# EAGLE schematic main (EAGLE 6.2)
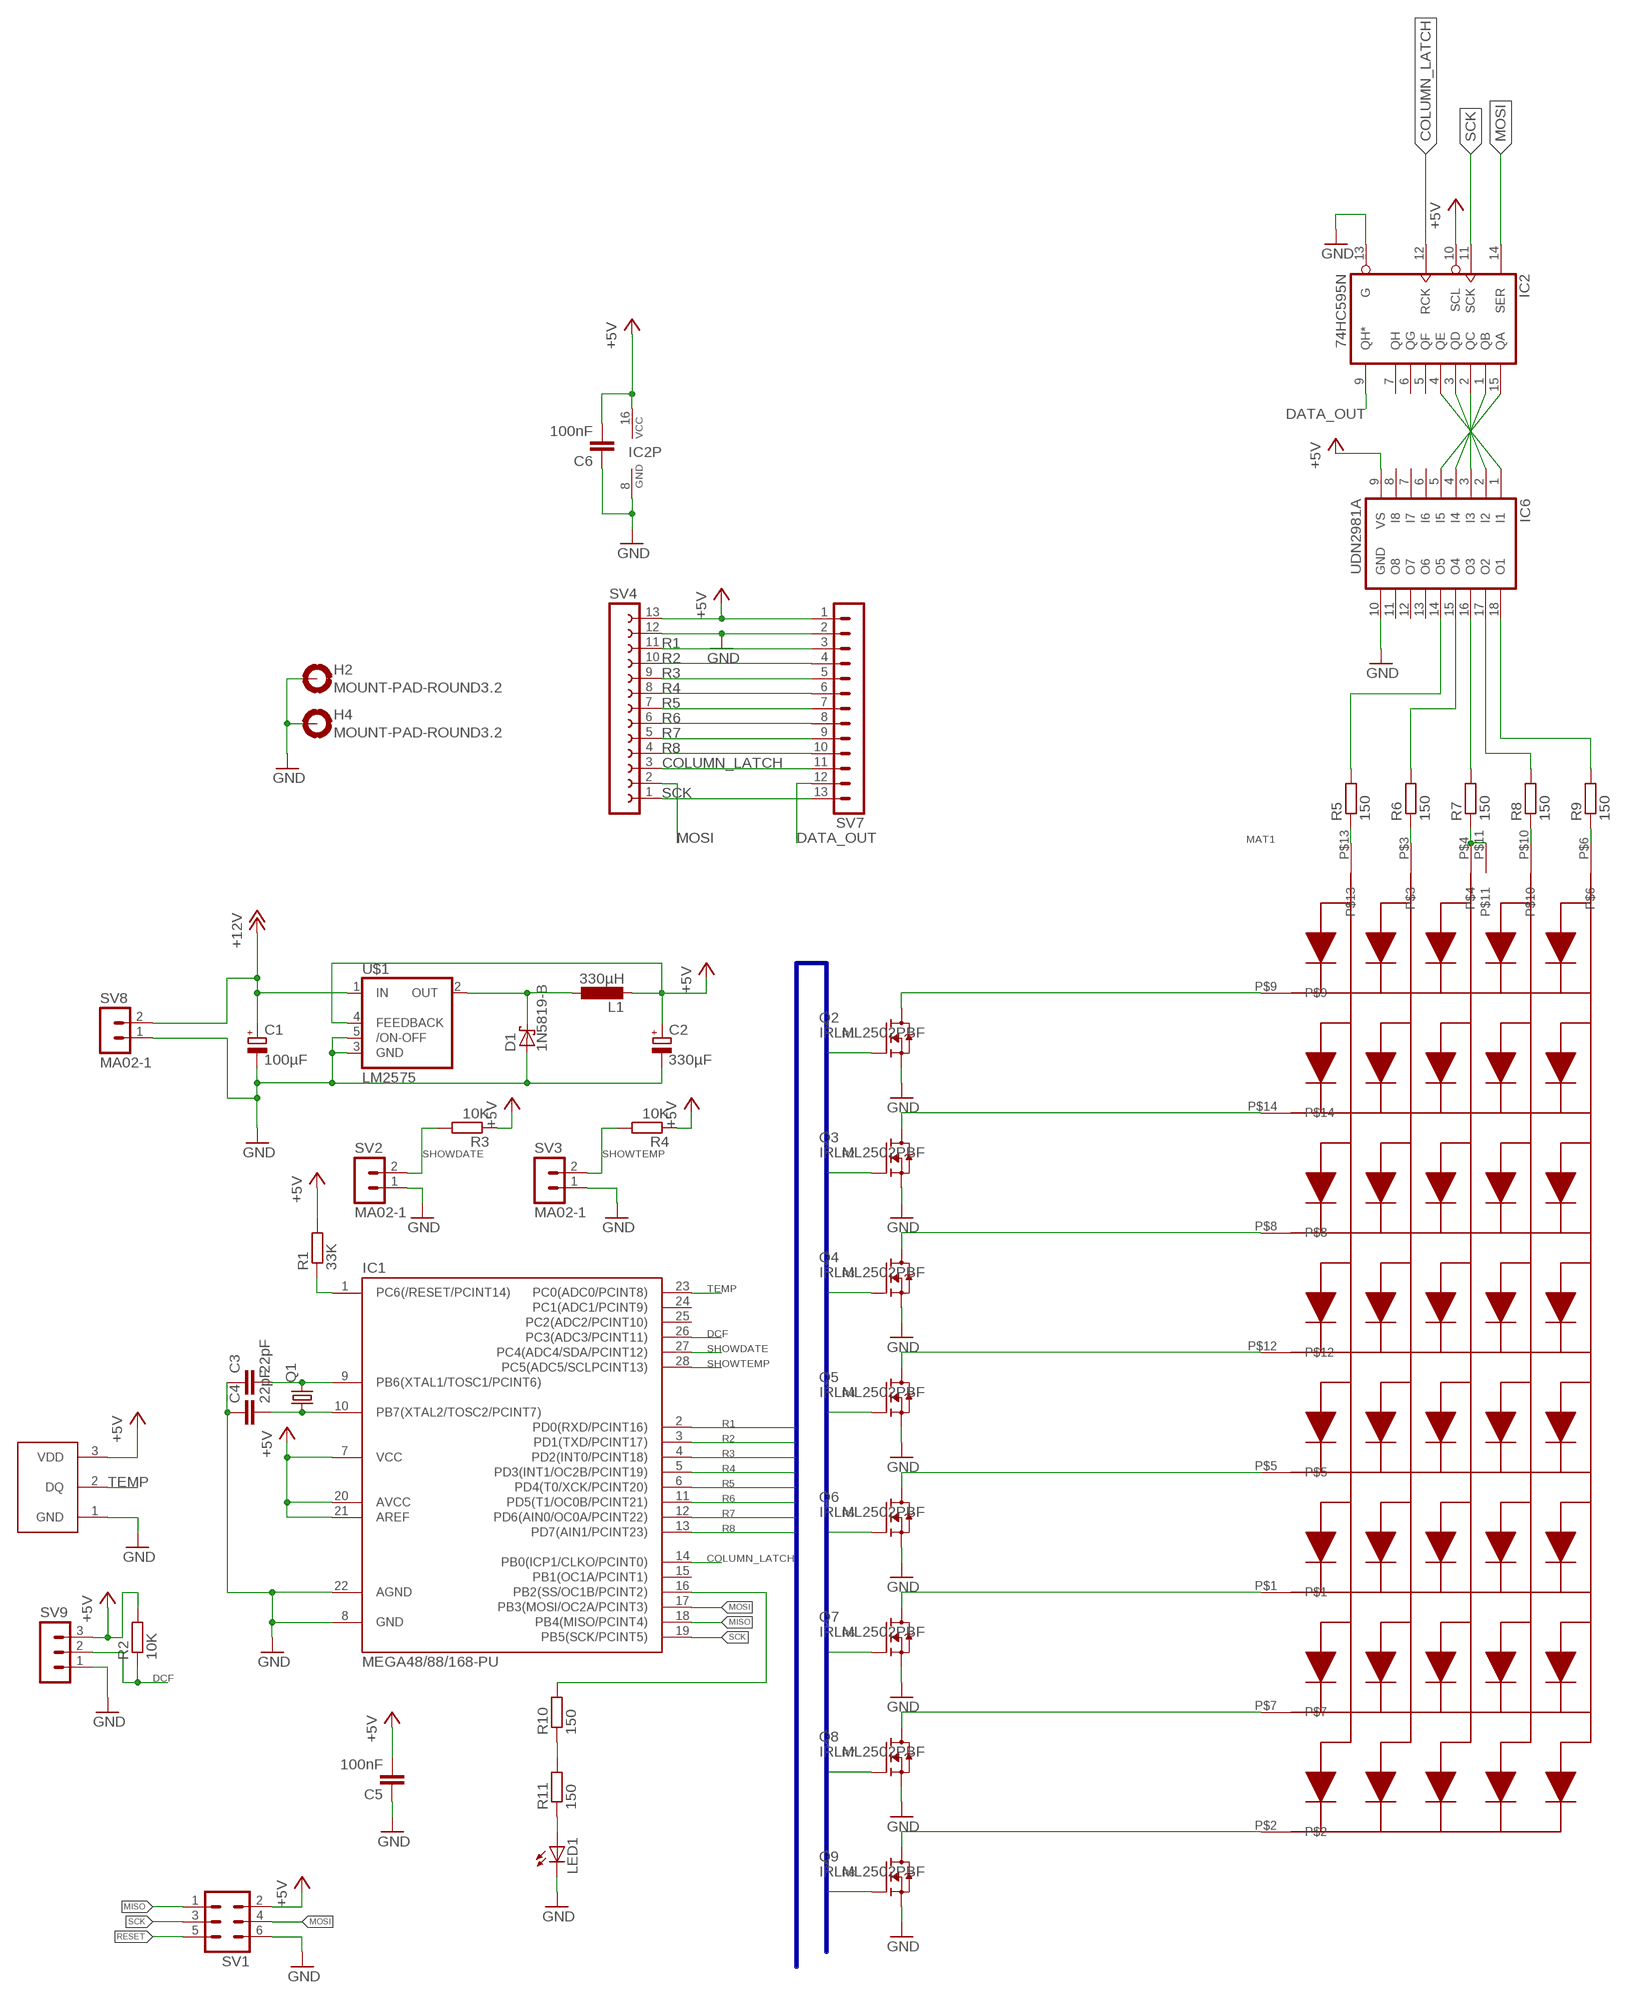
[diagram p0: schematic, sheet 1]

## Parts
C1  100µF  CPOL-EUE2.5-5  [E2,5-5]
C2  330µF  CPOL-EUE3.5-8  [E3,5-8]
C3  22pF  C-EU025-025X050  [C025-025X050]
C4  22pF  C-EU025-025X050  [C025-025X050]
C5  100nF  C-EUC0805  [C0805]
C6  100nF  C-EUC0805  [C0805]
D1  1N5819-B  [DO41-7.6]
H2  MOUNT-PAD-ROUND3.2  [3,2-PAD]
H4  MOUNT-PAD-ROUND3.2  [3,2-PAD]
IC1  MEGA48/88/168-PU  [DIL28-3]
IC2  74HC595N  [DIL16]
IC6  UDN2981A  [DIL18]
L1  330µH  L-EU0204V  [0204V]
LED1  LEDSML1206  [SML1206]
MAT1  5X8  [5X8]
Q1  CRYSTALHC49S  [HC49/S]
Q2  IRLML2502PBF  [SOT23]
Q3  IRLML2502PBF  [SOT23]
Q4  IRLML2502PBF  [SOT23]
Q5  IRLML2502PBF  [SOT23]
Q6  IRLML2502PBF  [SOT23]
Q7  IRLML2502PBF  [SOT23]
Q8  IRLML2502PBF  [SOT23]
Q9  IRLML2502PBF  [SOT23]
R1  33K  R-EU_R0805  [R0805]
R2  10K  R-EU_R0805  [R0805]
R3  10K  R-EU_R0805  [R0805]
R4  10K  R-EU_R0805  [R0805]
R5  150  R-EU_R0805  [R0805]
R6  150  R-EU_R0805  [R0805]
R7  150  R-EU_R0805  [R0805]
R8  150  R-EU_R0805  [R0805]
R9  150  R-EU_R0805  [R0805]
R10  150  R-EU_R0805  [R0805]
R11  150  R-EU_R0805  [R0805]
SV1  MA03-2  [MA03-2]
SV2  MA02-1  [MA02-1]
SV3  MA02-1  [MA02-1]
SV4  FE13W  [FE13W]
SV7  MA13-1W  [MA13-1W]
SV8  MA02-1  [MA02-1]
SV9  MA03-1  [MA03-1]
U$1  LM2575  [LM2575]
U$2  DS18B20  [TO92]

## Nets
+5V: C2.+ C5.2 C6.2 IC1.7(VCC) IC1.20(AVCC) IC1.21(AREF) IC2.10(SCL) IC2.16(VCC) IC6.9(VS) L1.2 R1.2 R2.2 R3.1 R4.1 SV1.2 SV4.13 SV7.1 SV9.3 U$1.4(FEEDBACK) U$2.3(VDD)
+12V: C1.+ SV8.2 U$1.1(IN)
COLUMN_LATCH: IC1.14(PB0(ICP1/CLKO/PCINT0)) IC2.12(RCK) SV4.3 SV7.11
DATA_OUT: IC2.9(QH*) SV7.12
DCF: IC1.26(PC3(ADC3/PCINT11)) R2.1 SV9.2
GND: C1.- C2.- C3.1 C4.1 C5.1 C6.1 D1.A H2.B3,2(MOUNT) H4.B3,2(MOUNT) IC1.8(GND) IC1.22(AGND) IC2.8(GND) IC2.13(G) IC6.10(GND) LED1.C Q2.2(S) Q3.2(S) Q4.2(S) Q5.2(S) Q6.2(S) Q7.2(S) Q8.2(S) Q9.2(S) SV1.6 SV2.1 SV3.1 SV4.12 SV7.2 SV8.1 SV9.1 U$1.3(GND) U$1.5(/ON-OFF) U$2.1(GND)
MISO: IC1.18(PB4(MISO/PCINT4)) SV1.1
MOSI: IC1.17(PB3(MOSI/OC2A/PCINT3)) IC2.14(SER) SV1.4 SV4.2
N$1: IC6.15(O4) R6.2
N$2: C4.2 IC1.10(PB7(XTAL2/TOSC2/PCINT7)) Q1.1
N$3: D1.C L1.1 U$1.2(OUT)
N$4: C3.2 IC1.9(PB6(XTAL1/TOSC1/PCINT6)) Q1.2
N$5: IC6.16(O3) R7.2
N$6: IC6.17(O2) R8.2
N$7: MAT1.P$10 R8.1
N$8: MAT1.P$4 MAT1.P$11 R7.1
N$9: IC2.15(QA) IC6.5(I5)
N$10: IC2.1(QB) IC6.4(I4)
N$11: IC2.2(QC) IC6.3(I3)
N$12: IC2.3(QD) IC6.2(I2)
N$13: IC2.4(QE) IC6.1(I1)
N$14: MAT1.P$6 R9.1
N$15: IC6.18(O1) R9.2
N$16: MAT1.P$3 R6.1
N$17: MAT1.P$13 R5.1
N$29: IC1.16(PB2(SS/OC1B/PCINT2)) R10.2
N$30: IC6.14(O5) R5.2
N$31: R10.1 R11.2
N$32: LED1.A R11.1
N$58: MAT1.P$9 Q2.3(D)
N$59: MAT1.P$2 Q9.3(D)
N$60: MAT1.P$7 Q8.3(D)
N$61: MAT1.P$1 Q7.3(D)
N$62: MAT1.P$5 Q6.3(D)
N$63: MAT1.P$12 Q5.3(D)
N$64: MAT1.P$8 Q4.3(D)
N$65: MAT1.P$14 Q3.3(D)
R1: IC1.2(PD0(RXD/PCINT16)) Q2.1(G) SV4.11 SV7.3
R2: IC1.3(PD1(TXD/PCINT17)) Q3.1(G) SV4.10 SV7.4
R3: IC1.4(PD2(INT0/PCINT18)) Q4.1(G) SV4.9 SV7.5
R4: IC1.5(PD3(INT1/OC2B/PCINT19)) Q5.1(G) SV4.8 SV7.6
R5: IC1.6(PD4(T0/XCK/PCINT20)) Q6.1(G) SV4.7 SV7.7
R6: IC1.11(PD5(T1/OC0B/PCINT21)) Q7.1(G) SV4.6 SV7.8
R7: IC1.12(PD6(AIN0/OC0A/PCINT22)) Q8.1(G) SV4.5 SV7.9
R8: IC1.13(PD7(AIN1/PCINT23)) Q9.1(G) SV4.4 SV7.10
RESET: IC1.1(PC6(/RESET/PCINT14)) R1.1 SV1.5
SCK: IC1.19(PB5(SCK/PCINT5)) IC2.11(SCK) SV1.3 SV4.1 SV7.13
SHOWDATE: IC1.27(PC4(ADC4/SDA/PCINT12)) R3.2 SV2.2
SHOWTEMP: IC1.28(PC5(ADC5/SCLPCINT13)) R4.2 SV3.2
TEMP: IC1.23(PC0(ADC0/PCINT8)) U$2.2(DQ)
Unconnected: IC1.15(PB1(OC1A/PCINT1)) IC1.24(PC1(ADC1/PCINT9)) IC1.25(PC2(ADC2/PCINT10)) IC2.5(QF) IC2.6(QG) IC2.7(QH) IC6.6(I6) IC6.7(I7) IC6.8(I8) IC6.11(O8) IC6.12(O7) IC6.13(O6)

## Buses
R[1..8]

## Library data of the parts
C1 C2 = rcl:CPOL-EU: POLARIZED CAPACITOR, European symbol
C3-C6 = rcl:C-EU: CAPACITOR, European symbol
D1 = diode:1N581*: 1.0A SCHOTTKY BARRIER RECTIFIER Source: http://www.diodes.com/datasheets/ds23001.pdf
H2 H4 = holes:MOUNT-PAD-ROUND: MOUNTING PAD, round
IC1 = avr-7:MEGA48/88/168-PU
IC2 = 74xx-eu:74*595: 8-bit SHIFT REGISTER, output latch
IC6 = uln-udn:UDN298*: DRIVER ARRAY Source: Allegro Microsystems Inc. / UDN2981-UDN2984.pdf
L1 = rcl:L-EU: INDUCTOR, European symbol
LED1 = led:LED: LED OSRAM: - CHIPLED LG R971, LG N971, LY N971, LG Q971, LY Q971, LO R971, LY R971 LH N974, LH R974 LS Q976, LO Q976, LY Q976 LO Q996 - Hyper CHIPLED LW Q18S LB Q993, LB Q99A, LB R99A - SideLED LS A670, LO A670, LY A670, LG A670, LP A670 LB A673, LV A673, LT A673, LW A673 LH A674 LY A675 LS A676, LA A676, LO A676, LY A676, LW A676 LS A679, LY A679, LG A679 - Hyper Micro SIDELED® LS Y876, LA Y876, LO Y876, LY Y876 LT Y87S - SmartLED LW L88C, LW L88S LB L89C, LB L89S, LG L890 LS L89K, LO L89K, LY L89K LS L896, LA L896, LO L896, LY L896 - TOPLED LS T670, LO T670, LY T670, LG T670, LP T670 LSG T670, LSP T670, LSY T670, LOP T670, LYG T670 LG T671, LOG T671, LSG T671 LB T673, LV T673, LT T673, LW T673 LH T674 LS T676, LA T676, LO T676, LY T676, LB T676, LH T676, LSB T676, LW T676 LB T67C, LV T67C, LT T67C, LS T67K, LO T67K, LY T67K, LW E67C LS E67B, LA E67B, LO E67B, LY E67B, LB E67C, LV E67C, LT E67C LW T67C LS T679, LY T679, LG T679 LS T770, LO T770, LY T770, LG T770, LP T770 LB T773, LV T773, LT T773, LW T773 LH T774 LS E675, LA E675, LY E675, LS T675 LS T776, LA T776, LO T776, LY T776, LB T776 LHGB T686 LT T68C, LB T68C - Hyper Mini TOPLED® LB M676 - Mini TOPLED Santana® LG M470 LS M47K, LO M47K, LY M47K Source: http://www.osram.convergy.de LUXEON: - LUMILED® LXK2-PW12-R00, LXK2-PW12-S00, LXK2-PW14-U00, LXK2-PW14-V00 LXK2-PM12-R00, LXK2-PM12-S00, LXK2-PM14-U00 LXK2-PE12-Q00, LXK2-PE12-R00, LXK2-PE12-S00, LXK2-PE14-T00, LXK2-PE14-U00 LXK2-PB12-K00, LXK2-PB12-L00, LXK2-PB12-M00, LXK2-PB14-N00, LXK2-PB14-P00, LXK2-PB14-Q00 LXK2-PR12-L00, LXK2-PR12-M00, LXK2-PR14-Q00, LXK2-PR14-R00 LXK2-PD12-Q00, LXK2-PD12-R00, LXK2-PD12-S00 LXK2-PH12-R00, LXK2-PH12-S00 LXK2-PL12-P00, LXK2-PL12-Q00, LXK2-PL12-R00 Source: www.luxeon.com KINGBRIGHT: KA-3528ASYC Source: www.kingbright.com
MAT1 = dotmatrix:5X8
Q1 = crystal:CRYSTAL: CRYSTAL; OC_FARNELL: 1667008; OC_NEWARK: unknown
Q2-Q9 = transistor-fet:IRLML2502PBF
R1-R11 = rcl:R-EU_: RESISTOR, European symbol
SV1 = con-lstb:MA03-2: PIN HEADER; OC_FARNELL: unknown; OC_NEWARK: unknown
SV2 SV3 SV8 = con-lstb:MA02-1
SV4 = con-lsta:FE13W: FEMALE HEADER; OC_FARNELL: unknown; OC_NEWARK: unknown
SV7 = con-lstb:MA13-1W: PIN HEADER; OC_FARNELL: unknown; OC_NEWARK: unknown
SV9 = con-lstb:MA03-1: PIN HEADER; OC_FARNELL: unknown; OC_NEWARK: unknown
U$1 = joep-custom:LM2575
U$2 = joep-custom:DS18B20